# EAGLE design Lulu_MCU (EAGLE 8.4.3)
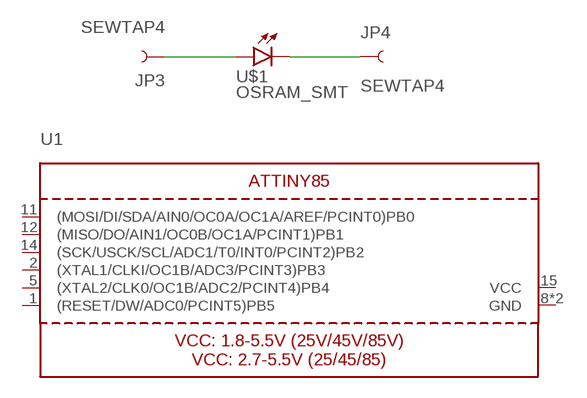
[diagram p0: schematic, sheet 1]

## Parts
JP3  SEWTAP4  [PETAL-SMALL]
JP4  SEWTAP4  [PETAL-SMALL]
U1  ATTINY85  [MLF20_4X4MM_0.5MM_ATMEL]
U$1  OSRAM_SMT  [OSLON]

## Nets
N$1: JP3.1 U$1.A
N$3: JP4.1 U$1.C
Unconnected: U1.1((RESET/DW/ADC0/PCINT5)PB5) U1.2((XTAL1/CLKI/OC1B/ADC3/PCINT3)PB3) U1.5((XTAL2/CLK0/OC1B/ADC2/PCINT4)PB4) U1.11((MOSI/DI/SDA/AIN0/OC0A/OC1A/AREF/PCINT0)PB0) U1.12((MISO/DO/AIN1/OC0B/OC1A/PCINT1)PB1) U1.14((SCK/USCK/SCL/ADC1/T0/INT0/PCINT2)PB2) U$1.COOL@0(TH) U$1.COOL@1(TH) U$1.COOL@2(TH) U$1.COOL@3(TH) U$1.COOL@4(TH) U$1.COOL@5(TH) U$1.COOL@6(TH) U$1.COOL@7(TH) U$1.COOL@8(TH) U$1.COOL@9(TH) U$1.COOL@10(TH) U$1.COOL@11(TH) U$1.COOL@12(TH) U$1.COOL@13(TH) U$1.COOL@14(TH)

## Power pins joined to a net without a drawn wire
GND: U1.8(GND) U1.THERMAL(GND)
VCC: U1.15(VCC)

## Library data of the parts
JP3 JP4 = LilyPad-Wearables:SEWTAP: Sew Taps for LilyPad Boards.
U1 = microbuilder:ATTINY85: ATTINT85
U$1 = OSRAM:OSRAM_SMT

## Board
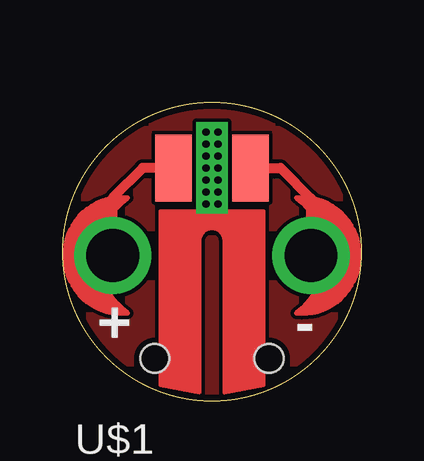
[diagram p1: board, top side]
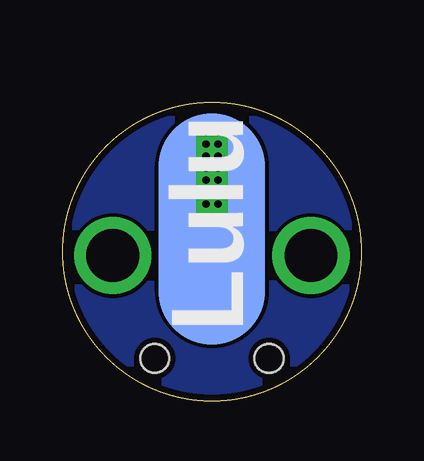
[diagram p2: board, bottom side, seen from below]

Size 12.45 x 12.45 mm. Coordinates in mm from the lower left corner, seen from the top.
Outline: circle at 6.22,6.22 radius 6.22
Copper layers (1*16): Top 0.035mm / dielectric 1.5mm / Bottom 0.035mm
Design rules "SeeedStudio_2layer_DRU_no_angle_20140221 *": minimum track width 6mil, minimum drill 0.3mm, track to track 6mil, track to pad 6mil, pad to pad 6mil, via to via 6mil, smd to smd 0mil, copper to edge 10mil, drill to drill 10mil, minimum pad ring 10mil, minimum via ring 6mil, stop-mask expansion 2mil, vias tented up to drill 100mil, thermal gap 10mil
Holes 1.2 mm at 3.84,1.78 8.6,1.78

### Footprints (pad centres in the part's own frame; a part is rotated, then mirrored left to right if it is on the bottom)
PETAL-SMALL = drill 2.2: 1 0,0
MLF20_4X4MM_0.5MM_ATMEL = smd 0.8 x 0.25: 1 -2,1; 2 -2,0.5; 3 -2,0; 4 -2,-0.5; 5 -2,-1; 11 2,-1; 12 2,-0.5; 13 2,0; 14 2,0.5; 15 2,1 | smd 0.25 x 0.8: 6 -1,-2; 7 -0.5,-2; 8 0,-2; 9 0.5,-2; 10 1,-2; 16 1,2; 17 0.5,2; 18 0,2; 19 -0.5,2; 20 -1,2 | smd 2.6 x 2.6: THERMAL 0,0
OSLON = smd 1.524 x 2.8: A 1.6,0; C -1.6,0 | drill 0.3 pad 0.5 square: COOL@0 -0.25,1.5; COOL@1 0.25,1.5; COOL@2 -0.25,1; COOL@3 0.25,1; COOL@4 -0.25,0.5; COOL@5 0.25,0.5; COOL@6 -0.25,0; COOL@7 0.25,0; COOL@8 -0.25,-0.5; COOL@9 0.25,-0.5; COOL@10 -0.25,-1; COOL@11 0.25,-1; COOL@12 -0.25,-1.5; COOL@13 0.25,-1.5 | smd 4.445 x 9.652 bottom: COOL@14 0,-2.54

### Placement (x,y rotation side)
JP3  10.35,6.06 90 top
JP4  2.1,6.06 270 top
U1  20.03,6.22 0 top  (outside the outline)
U$1  6.22,9.72 0 top

### Tracks (layer width: path | path; a pad name or v marks a point on that pad's centre or on a via)
GND  (1 unrouted)
  pour Bottom: 1.9,10.45 arc-90 10.54,10.45 arc-90 10.54,2 arc-90 1.9,2 arc-90
  pour Top: 2.06,10.45 arc-90 10.7,10.45 arc-90 10.54,2 arc-90 1.9,2 arc-90
N$1
  Top 0.406: JP3.1 10.35,8.45 9.08,9.71 U$1.A
N$3
  Top 0.406: JP4.1 2.1,8.48 3.34,9.71 U$1.C

### Text on the board
_tsilk: + | -
_bsilk: Lulu